# EAGLE schematic IMU2_BREAKOUT (EAGLE 9.3.0)
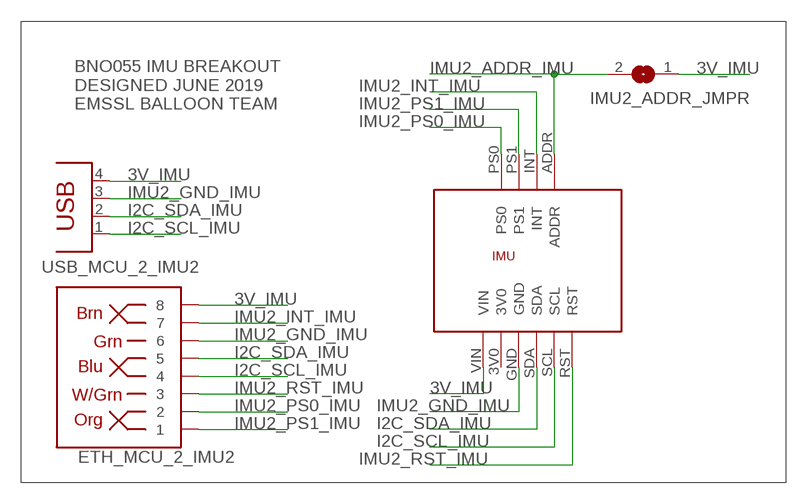
[diagram p0: schematic, sheet 1]

## Parts
ETH_MCU_2_IMU2  RJ45  RJ45-8  [RJ45-8]
IMU2  BNO055  [BNO055]
IMU2_ADDR_JMPR  SJ  [SJ]
USB_MCU_2_IMU2  PN87520  [PN87520]

## Nets
3V_IMU: ETH_MCU_2_IMU2.8 IMU2.VIN IMU2_ADDR_JMPR.1 USB_MCU_2_IMU2.4
I2C_SCL_IMU: ETH_MCU_2_IMU2.4 IMU2.SCL USB_MCU_2_IMU2.1
I2C_SDA_IMU: ETH_MCU_2_IMU2.5 IMU2.SDA USB_MCU_2_IMU2.2
IMU2_ADDR_IMU: IMU2.ADDR IMU2_ADDR_JMPR.2
IMU2_GND_IMU: ETH_MCU_2_IMU2.6 IMU2.GND USB_MCU_2_IMU2.3
IMU2_INT_IMU: ETH_MCU_2_IMU2.7 IMU2.INT
IMU2_PS0_IMU: ETH_MCU_2_IMU2.2 IMU2.PS0
IMU2_PS1_IMU: ETH_MCU_2_IMU2.1 IMU2.PS1
IMU2_RST_IMU: ETH_MCU_2_IMU2.3 IMU2.RST
Unconnected: IMU2.3V0

## Notes on the sheet
- BNO055 IMU BREAKOUT
  DESIGNED JUNE 2019
  EMSSL BALLOON TEAM

## Library data of the parts
ETH_MCU_2_IMU2 = SparkFun-Connectors:RJ45-8: RJ45 Jack - 8 pin Simple RJ45, 8-pin connection. Commonly used for Cat5, Cat5e, and Cat6 Ethernet cables. Here is the connector we sell at SparkFun: RJ45 8-Pin Connector <https://www.sparkfun.com/products/643> (PRT-00643) Datasheet <https://cdn.sparkfun.com/datasheets/Prototyping/04908.pdf> It is used on this SparkFun product: SparkFun RJ45 Breakout <https://www.sparkfun.com/products/716> (BOB-00716) Note, you may also be interested in the "MAGJACK" version of this. It is basically a RJ45 connector, but also has some status LEDs built into the connector housing. You can check that out in this library at the device named "MAGJACK.dev" and see these products online: RJ45 Ethernet MagJack-Compatible <https://www.sparkfun.com/products/8534> (PRT-08534) SparkFun RJ45 MagJack Breakout <https://www.sparkfun.com/products/13021> (BOB-13021); PROD_ID: CONN-08506; SF_ID: PRT-00643
IMU2 = Adafruit_Arduino:BNO055
IMU2_ADDR_JMPR = jumper:SJ: SMD solder JUMPER
USB_MCU_2_IMU2 = con-berg:PN87520: BERG USB connector; OC_FARNELL: unknown; OC_NEWARK: unknown